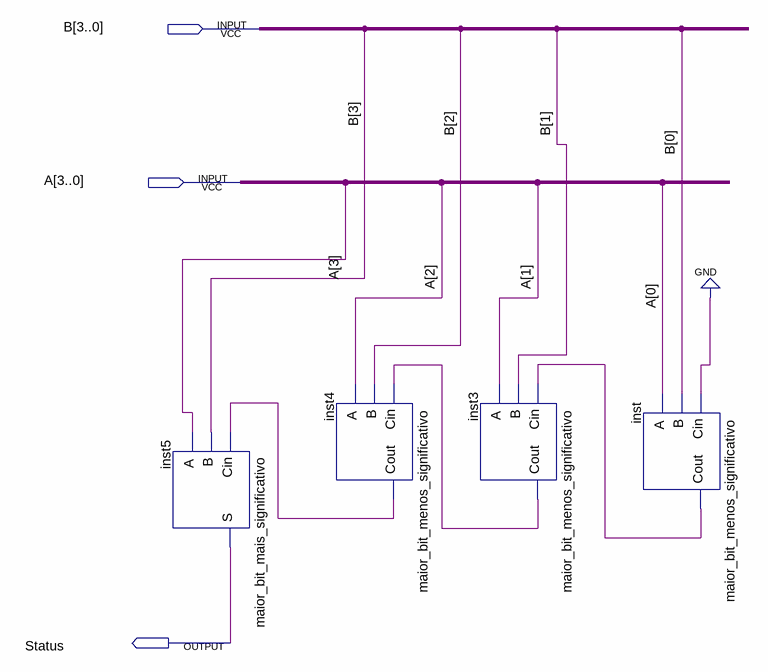
[diagram p0: schematic sheet]
// Quartus schematic comparador_maior.bdf as structural Verilog: 4 symbols, 3 pins
module comparador_maior (
  input  [3:0] B,
  input  [3:0] A,
  output Status
);

  wire inst3_cout, inst4_cout, inst_cout;

  maior_bit_mais_significativo inst5 (.Cin(inst4_cout), .B(B[3]), .A(A[3]), .S(Status));
  maior_bit_menos_significativo inst4 (.Cin(inst3_cout), .B(B[2]), .A(A[2]), .Cout(inst4_cout));
  maior_bit_menos_significativo inst3 (.Cin(inst_cout), .B(B[1]), .A(A[1]), .Cout(inst3_cout));
  maior_bit_menos_significativo inst (.Cin(1'b0), .B(B[0]), .A(A[0]), .Cout(inst_cout));
endmodule
